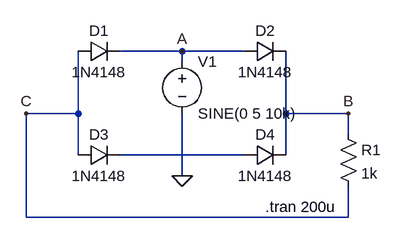
[diagram p0: schematic 1.2.1.asc]
1.2.1.asc, the LTspice schematic file:
Version 4
SHEET 1 880 680
WIRE 224 80 128 80
WIRE 320 80 224 80
WIRE 224 96 224 80
WIRE 64 176 64 80
WIRE 64 176 -16 176
WIRE 384 176 384 80
WIRE 480 176 384 176
WIRE 480 208 480 176
WIRE 64 240 64 176
WIRE 320 240 128 240
WIRE 384 240 384 176
WIRE 224 272 224 176
WIRE -16 336 -16 176
WIRE 480 336 480 288
WIRE 480 336 -16 336
FLAG 224 272 0
FLAG 224 80 A
FLAG 480 176 B
FLAG -16 176 C
SYMBOL voltage 224 80 R0
WINDOW 123 0 0 Left 0
WINDOW 39 0 0 Left 0
SYMATTR InstName V1
SYMATTR Value SINE(0 5 10k)
SYMBOL diode 64 96 R270
WINDOW 0 32 32 VTop 2
WINDOW 3 0 32 VBottom 2
SYMATTR InstName D1
SYMATTR Value 1N4148
SYMBOL diode 320 96 R270
WINDOW 0 32 32 VTop 2
WINDOW 3 0 32 VBottom 2
SYMATTR InstName D2
SYMATTR Value 1N4148
SYMBOL diode 64 256 R270
WINDOW 0 32 32 VTop 2
WINDOW 3 0 32 VBottom 2
SYMATTR InstName D3
SYMATTR Value 1N4148
SYMBOL diode 320 256 R270
WINDOW 0 32 32 VTop 2
WINDOW 3 0 32 VBottom 2
SYMATTR InstName D4
SYMATTR Value 1N4148
SYMBOL res 464 192 R0
SYMATTR InstName R1
SYMATTR Value 1k
TEXT 352 320 Left 2 !.tran 200u

The netlist it stands for:
* 1.2.1.asc
V1 A 0 SINE(0 5 10k)
D1 C A 1N4148
D2 A B 1N4148
D3 C N001 1N4148
D4 N001 B 1N4148
R1 B C 1k
.model D D
.lib standard.dio
.tran 200u
.backanno
.end

* Results of the author's LTspice run, read from the files saved beside the schematic
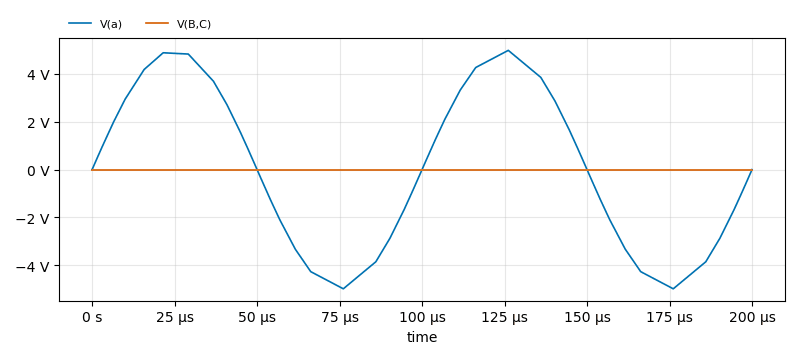
[diagram p1: Transient Analysis of 1.2.1.asc, plotted from the saved traces]
* Transient Analysis, 1 run:
*   V(a): min -4.983 V, max 4.983 V, average 6.673 mV, rms 3.479 V, last 0 V
*   V(B,C): min -1.332 fV, max 0 V, average -0.0004484 fV, rms 0.02444 fV, last -1.332 fV